# EAGLE design Rev1 (EAGLE 7.7.0)
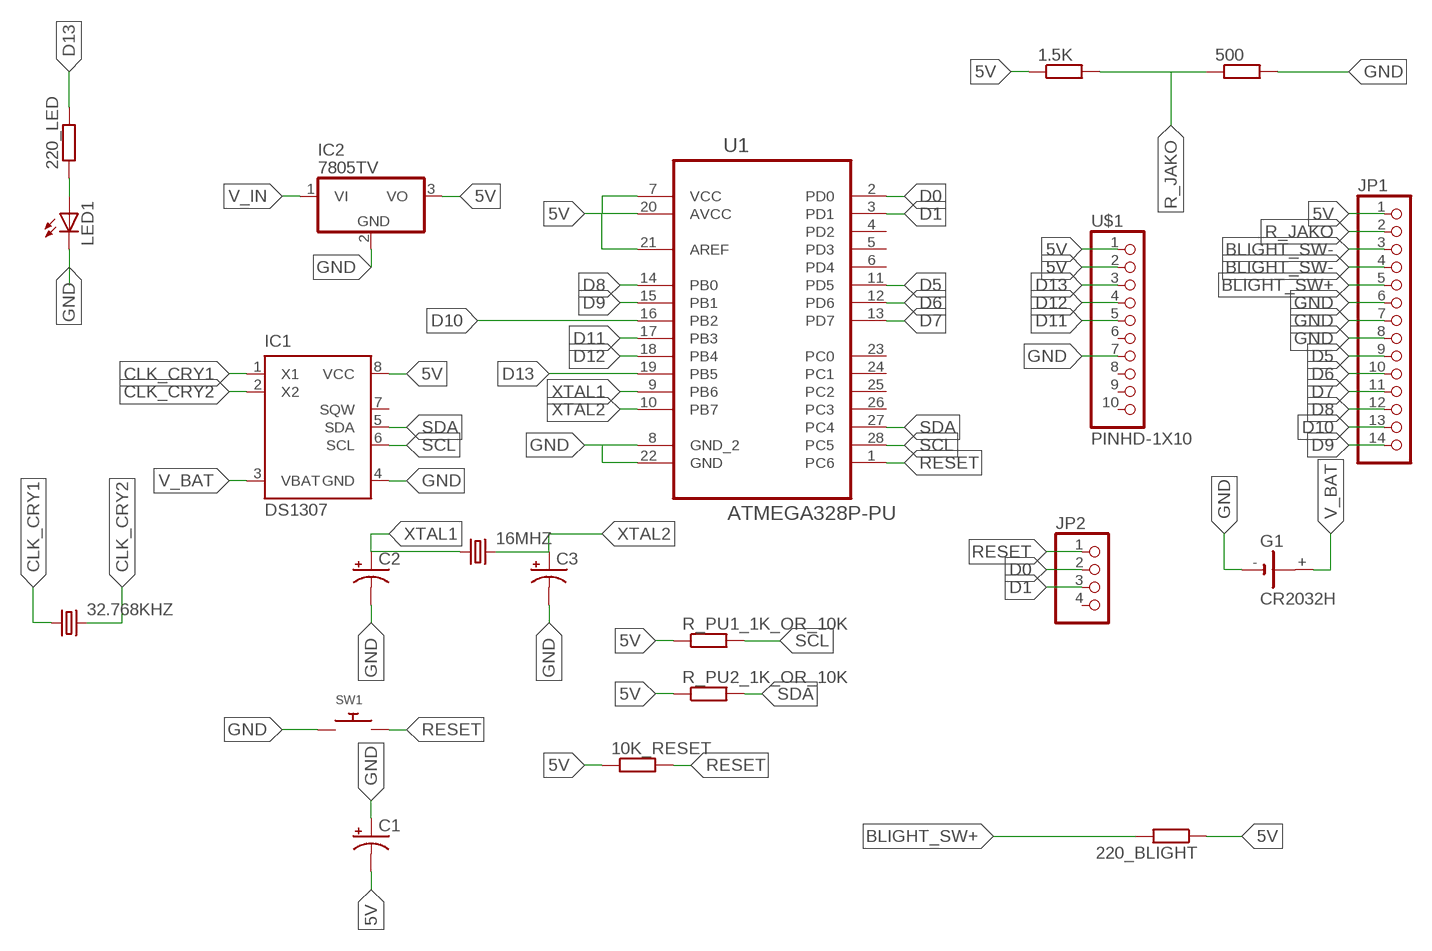
[diagram p0: schematic, sheet 1]

## Parts
1.5K  R-EU_0207/10  [0207/10]
10K_RESET  R-EU_0207/10  [0207/10]
16MHZ  CRYSTALHC49S  [HC49/S]
32.768KHZ  CRYSTALTC38H  [TC38H]
220_BLIGHT  R-EU_0207/10  [0207/10]
220_LED  R-EU_0207/10  [0207/10]
500  R-EU_0207/10  [0207/10]
C1  CPOL-USE2,5-6E  [E2,5-6E]
C2  CPOL-USE2,5-6E  [E2,5-6E]
C3  CPOL-USE2,5-6E  [E2,5-6E]
G1  CR2032H  [CR2032H]
IC1  DS1307  [DIP-8]
IC2  7805TV  [TO220V]
JP1  PINHD-1X14  [1X14]
JP2  PINHD-1X4  [1X04]
LED1  LED3MM  [LED3MM]
R_PU1_1K_OR_10K  R-EU_0207/10  [0207/10]
R_PU2_1K_OR_10K  R-EU_0207/10  [0207/10]
SW1  SWITCH_PUSHBUTTONEVQ-PE  [TACT_PANA-EVQ]
U1  ATMEGA328P-PU  [DIP254P762X457-28]
U$1  PINHD-1X10  [1X10-BIG]

## Nets
5V: 1.5K.1 10K_RESET.1 220_BLIGHT.1 C1.- IC1.8(VCC) IC2.3(VO) JP1.1 R_PU1_1K_OR_10K.1 R_PU2_1K_OR_10K.1 U1.7(VCC) U1.20(AVCC) U1.21(AREF) U$1.1 U$1.2
BLIGHT_SW+: 220_BLIGHT.2 JP1.5
BLIGHT_SW-: JP1.3 JP1.4
CLK_CRY1: 32.768KHZ.1 IC1.1(X1)
CLK_CRY2: 32.768KHZ.2 IC1.2(X2)
D0: JP2.2 U1.2(PD0)
D1: JP2.3 U1.3(PD1)
D5: JP1.9 U1.11(PD5)
D6: JP1.10 U1.12(PD6)
D7: JP1.11 U1.13(PD7)
D8: JP1.12 U1.14(PB0)
D9: JP1.14 U1.15(PB1)
D10: JP1.13 U1.16(PB2)
D11: U1.17(PB3) U$1.5
D12: U1.18(PB4) U$1.4
D13: 220_LED.2 U1.19(PB5) U$1.3
GND: 500.2 C1.+ C2.- C3.- G1.- IC1.4(GND) IC2.2(GND) JP1.6 JP1.7 JP1.8 LED1.K(C) SW1.P$1 U1.8(GND_2) U1.22(GND) U$1.7
N$23: 220_LED.1 LED1.A
R_JAKO: 1.5K.2 500.1 JP1.2
RESET: 10K_RESET.2 JP2.1 SW1.P$2 U1.1(PC6)
SCL: IC1.6(SCL) R_PU1_1K_OR_10K.2 U1.28(PC5)
SDA: IC1.5(SDA) R_PU2_1K_OR_10K.2 U1.27(PC4)
V_BAT: G1.+ IC1.3(VBAT)
V_IN: IC2.1(VI)
XTAL1: 16MHZ.1 C2.+ U1.9(PB6)
XTAL2: 16MHZ.2 C3.+ U1.10(PB7)
Unconnected: G1.+@1(+) IC1.7(SQW) JP2.4 U1.4(PD2) U1.5(PD3) U1.6(PD4) U1.23(PC0) U1.24(PC1) U1.25(PC2) U1.26(PC3) U$1.6 U$1.8 U$1.9 U$1.10

## Library data of the parts
1.5K 10K_RESET 220_BLIGHT 220_LED 500 R_PU1_1K_OR_10K R_PU2_1K_OR_10K = resistor:R-EU_: RESISTOR, European symbol
16MHZ = adafruit:CRYSTAL: CRYSTAL; OC_FARNELL: 1667008; OC_NEWARK: unknown
32.768KHZ = adafruit:CRYSTAL: CRYSTAL; OC_FARNELL: unknown; OC_NEWARK: unknown
C1-C3 = adafruit:CPOL-US: POLARIZED CAPACITOR, American symbol
G1 = battery:CR2032H: LI BATTERY Varta
IC1 = DS1307:DS1307: DS1307 - 64×8, Serial, I2C Real Time Clock
IC2 = linear:78*: Positive VOLTAGE REGULATOR Source: http://cache.national.com/ds/LM/LM78L05.pdf http://www.fairchildsemi.com/ds/LM/LM7805.pdf
JP1 = adafruit:PINHD-1X14: PIN HEADER
JP2 = pinhead:PINHD-1X4: PIN HEADER
LED1 = adafruit:LED: LED OSRAM: - CHIPLED LG R971, LG N971, LY N971, LG Q971, LY Q971, LO R971, LY R971 LH N974, LH R974 LS Q976, LO Q976, LY Q976 LO Q996 - Hyper CHIPLED LW Q18S LB Q993, LB Q99A, LB R99A - SideLED LS A670, LO A670, LY A670, LG A670, LP A670 LB A673, LV A673, LT A673, LW A673 LH A674 LY A675 LS A676, LA A676, LO A676, LY A676, LW A676 LS A679, LY A679, LG A679 - Hyper Micro SIDELED® LS Y876, LA Y876, LO Y876, LY Y876 LT Y87S - SmartLED LW L88C, LW L88S LB L89C, LB L89S, LG L890 LS L89K, LO L89K, LY L89K LS L896, LA L896, LO L896, LY L896 - TOPLED LS T670, LO T670, LY T670, LG T670, LP T670 LSG T670, LSP T670, LSY T670, LOP T670, LYG T670 LG T671, LOG T671, LSG T671 LB T673, LV T673, LT T673, LW T673 LH T674 LS T676, LA T676, LO T676, LY T676, LB T676, LH T676, LSB T676, LW T676 LB T67C, LV T67C, LT T67C, LS T67K, LO T67K, LY T67K, LW E67C LS E67B, LA E67B, LO E67B, LY E67B, LB E67C, LV E67C, LT E67C LW T67C LS T679, LY T679, LG T679 LS T770, LO T770, LY T770, LG T770, LP T770 LB T773, LV T773, LT T773, LW T773 LH T774 LS E675, LA E675, LY E675, LS T675 LS T776, LA T776, LO T776, LY T776, LB T776 LHGB T686 LT T68C, LB T68C - Hyper Mini TOPLED® LB M676 - Mini TOPLED Santana® LG M470 LS M47K, LO M47K, LY M47K Source: http://www.osram.convergy.de/
SW1 = adafruit:SWITCH_PUSHBUTTON: Buttons SOFTTOUCHSMD_SJ - Soft touch temporary push button (Super Junk Akihabara) Compatible with SKPMANE010 [Mouser: 688-SKPMAN] C&K_KSS = Digikey: KSS221GLFS
U1 = Atmel_By_element14_Batch_1-00:ATMEGA328P-PU: 8-bit Microcontroller with In-System Programmable Flash; MPN: ATMEGA328P-PU; OC_FARNELL: 1715487; OC_NEWARK: 15R0268; PACKAGE: PDIP-28; SUPPLIER: Atmel
U$1 = adafruit:PINHD-1X10: Pin header 1x10 0.1" spacing With round pins

## Board
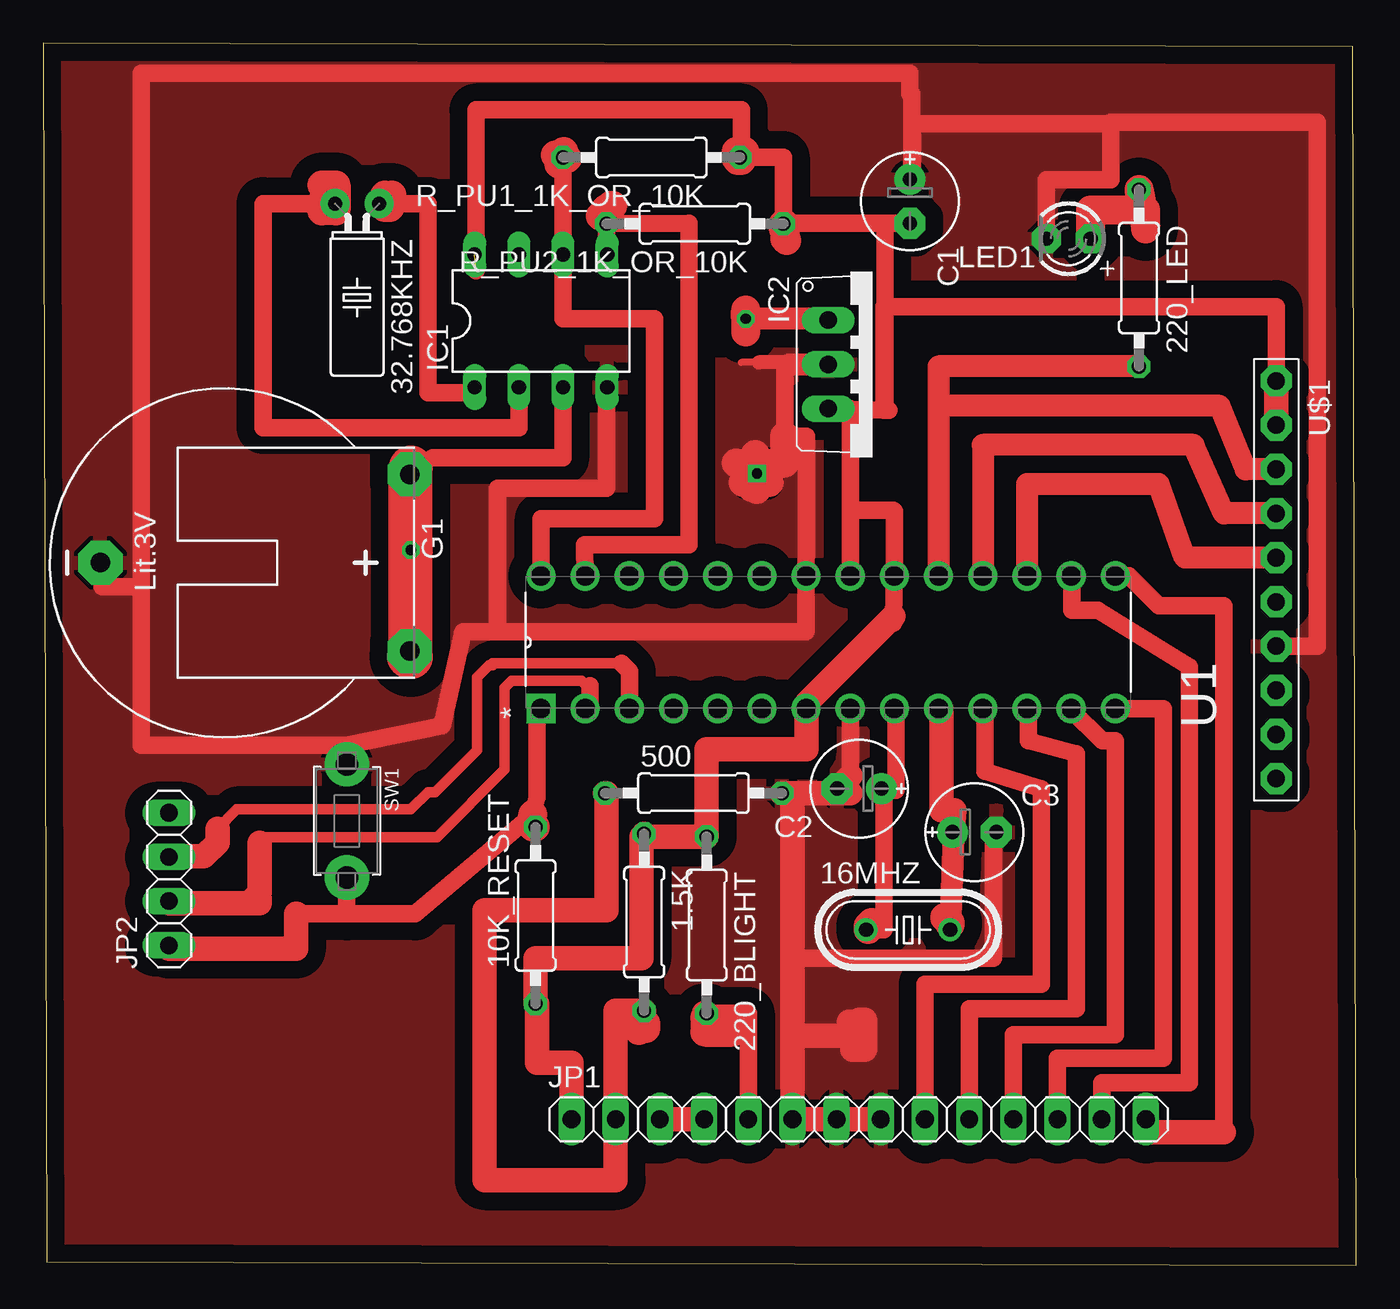
[diagram p1: board, top side]

Size 75.46 x 70.22 mm. Coordinates in mm from the lower left corner, seen from the top.
Outline: 0.2,0.2 75.46,0 75.26,70.02 0,70.22 0.2,0.2
Copper layers (1*16): Top 0.035mm / dielectric 1.5mm / Bottom 0.035mm
Design rules "default *": minimum track width 10mil, minimum drill 24mil, track to track 40mil, track to pad 30mil, pad to pad 20mil, via to via 20mil, smd to smd 8mil, copper to edge 40mil, drill to drill 8mil, minimum pad ring 10mil, minimum via ring 8mil, stop-mask expansion 4mil, vias tented up to drill 0mil, thermal gap 10mil

### Footprints (pad centres in the part's own frame; a part is rotated, then mirrored left to right if it is on the bottom)
0207/10 = drill 0.813 octagon: 1 -5.08,0; 2 5.08,0
HC49/S = drill 0.813: 1 -2.413,0; 2 2.413,0
TC38H = drill 0.813 pad 1.676: 1 -1.27,0; 2 1.27,0
E2,5-6E = drill 0.813 pad 1.778: + -1.27,0 | drill 0.813 pad 1.778 octagon: - 1.27,0
CR2032H = drill 1.118 pad 2.54 octagon: + 5.08,10.795; +@1 -5.08,10.795; - 0,-6.985
DIP-8 = drill 0.813 long: 1 -3.81,-3.81; 2 -1.27,-3.81; 3 1.27,-3.81; 4 3.81,-3.81; 5 3.81,3.81; 6 1.27,3.81; 7 -1.27,3.81; 8 -3.81,3.81
TO220V = drill 1.016 long: 1 -2.54,-2.54; 2 0,-2.54; 3 2.54,-2.54
1X14 = drill 1.016 long: 1 -16.51,0; 2 -13.97,0; 3 -11.43,0; 4 -8.89,0; 5 -6.35,0; 6 -3.81,0; 7 -1.27,0; 8 1.27,0; 9 3.81,0; 10 6.35,0; 11 8.89,0; 12 11.43,0; 13 13.97,0; 14 16.51,0
1X04 = drill 1.016 long: 1 -3.81,0; 2 -1.27,0; 3 1.27,0; 4 3.81,0
LED3MM = drill 0.813 pad 1.676 octagon: A -1.27,0; K 1.27,0
TACT_PANA-EVQ = drill 1.3 pad 2.54: P$1 -3.25,0; P$2 3.25,0
DIP254P762X457-28 = drill 1.118 square: 1 -7.62,33.02 | drill 1.118: 2 -7.62,30.48; 3 -7.62,27.94; 4 -7.62,25.4; 5 -7.62,22.86; 6 -7.62,20.32; 7 -7.62,17.78; 8 -7.62,15.24; 9 -7.62,12.7; 10 -7.62,10.16; 11 -7.62,7.62; 12 -7.62,5.08; 13 -7.62,2.54; 14 -7.62,0; 15 0,0; 16 0,2.54; 17 0,5.08; 18 0,7.62; 19 0,10.16; 20 0,12.7; 21 0,15.24; 22 0,17.78; 23 0,20.32; 24 0,22.86; 25 0,25.4; 26 0,27.94; 27 0,30.48; 28 0,33.02
1X10-BIG = drill 1.016 pad 1.778 octagon: 1 -11.43,0; 2 -8.89,0; 3 -6.35,0; 4 -3.81,0; 5 -1.27,0; 6 1.27,0; 7 3.81,0; 8 6.35,0; 9 8.89,0; 10 11.43,0

### Placement (x,y rotation side)
1.5K  34.53,19.72 270 top
10K_RESET  28.29,20.11 90 top
16MHZ  49.71,19.28 0 top
32.768KHZ  18.03,61.02 180 top
220_BLIGHT  38.13,19.56 270 top
220_LED  62.98,56.74 270 top
500  37.37,27.14 0 top
C1  49.82,61.15 270 top
C2  46.9,27.4 180 top
C3  53.52,24.9 0 top
G1  10.26,40.38 270 top
IC1  28.6,54.28 0 top
IC2  47.65,51.78 270 top
JP1  46.87,8.4 0 top
JP2  7.22,22.2 90 top
LED1  58.93,59 180 top
R_PU1_1K_OR_10K  34.95,63.67 180 top
R_PU2_1K_OR_10K  37.45,59.86 180 top
SW1  17.44,25.54 270 top
U1  61.62,39.62 90 top
U$1  70.87,39.4 270 top

### Tracks (layer width: path | path; a pad name or v marks a point on that pad's centre or on a via)
5V  (1 unrouted)
  Top 1.016: U1.21 46.38,43.4 | 46.38,43.4 46.38,49.24 IC2.3 48.62,49.15 48.37,49.15 | C1.- 48.37,59.88 | 48.37,59.88 42.53,59.88 R_PU2_1K_OR_10K.1 42.53,63.67 R_PU1_1K_OR_10K.1 40.12,63.67 40.12,66.4 24.87,66.4 24.87,57.15 | 46.38,43.4 48.87,43.4 48.92,43.35 U1.20 48.88,37.31 48.87,36.9 | 48.37,49.15 48.37,59.88 | 48.37,49.15 48.32,49.15 48.32,55.1 70.87,55.1 U$1.1
  Top 1.422: U$1.1 U$1.2 | JP1.1 30.36,11.65 28.37,11.65 28.37,15.03 10K_RESET.1 28.29,17.65 34.37,17.65 34.37,24.64 34.53,24.64 | U1.7 43.87,32 | 43.87,32 43.87,29.65 38.13,29.65 220_BLIGHT.1 34.53,24.64 | 34.53,24.64 1.5K.1 | 43.87,32 43.87,32.3 48.88,37.31
  Top 1.676: 42.52,59.6 42.62,59.6 | 42.62,59.6 42.62,59 42.72,58.9 | R_PU2_1K_OR_10K.1 42.62,59.86 42.62,59.6
BLIGHT_SW+
  Top 1.016: 220_BLIGHT.2 40.52,14.48 JP1.5
  Top 1.422: 220_BLIGHT.2 37.98,14.48
BLIGHT_SW-
  Top 1.422: JP1.4 JP1.3
CLK_CRY1
  Top 1.016: IC1.1 24.79,50.15 22.12,50.15 22.12,61.02 32.768KHZ.1
CLK_CRY2
  Top 1.016: IC1.2 27.33,48.15 12.62,48.15 12.62,61.02 32.768KHZ.2
D0
  Top 0.61: 12.42,24.7 12.42,24.3 12.72,24.6 22.62,24.6 26.52,28.5 26.52,33.2 26.92,33.6 30.92,33.6 31.22,33.3 31.42,33.3
  Top 1.016: U1.2 31.42,32 31.42,33.3
  Top 1.422: 12.42,24.3 12.42,21.4 12.12,21.1 12.42,21.1 12.42,20.8 7.22,20.8 JP2.2
D1
  Top 0.61: 33.22,34.6 25.82,34.6 25.82,34.5 25.62,34.5 24.92,33.8 24.92,29.6 22.52,27.2 22.12,27.2 21.12,26.2 11.12,26.2 10.02,25.1
  Top 1.016: U1.3 33.68,34.14 33.22,34.6
  Top 1.422: 10.02,25.1 10.02,24.3 9.22,23.5 7.25,23.5 JP2.3
D5
  Top 1.016: U1.11 54.12,32 54.12,28.4 57.37,27.4 57.37,16.15 50.68,16.15 JP1.9
D6
  Top 1.016: U1.12 56.62,32 56.62,30.15 59.37,29.4 59.37,14.75 53.22,14.75 JP1.10
D7
  Top 1.016: U1.13 59.08,31.94 60.87,30.15 61.62,30.15 61.62,13.25 55.76,13.25 JP1.11
D8
  Top 1.016: U1.14 64.37,32 64.37,11.9 58.3,11.9 JP1.12
D9
  Top 1.016: U1.15 62.4,39.62 64.12,37.9 67.87,37.9 67.87,7.65
  Top 1.422: 67.87,7.65 63.38,7.65 JP1.14
D10
  Top 1.016: U1.16 59.12,39.62 59.12,37.65 60.62,37.65 65.87,34.4 65.87,10.5 60.84,10.5 JP1.13
D11
  Top 1.27: U$1.5 65.62,40.67 64.12,44.9 56.54,44.9 U1.17
D12
  Top 1.27: U$1.4 67.87,43.21 66.12,47.15 54,47.15 U1.18
D13
  Top 1.27: U$1.3 69.12,45.75 67.62,49.4 51.46,49.4 | 51.46,49.4 U1.19 | 220_LED.2 51.46,51.66 51.46,49.4
GND
  Top 0.406: 41.12,51.9 40.12,51.9
  Top 0.813: 45.11,51.9 41.12,51.9
  Top 1.016: U1.8 46.38,28.15 | 42.62,51.65 42.62,47.65 43.87,47.65 43.87,41.62 U1.22 43.84,36.4 26.12,36.4 | 42.62,51.65 44.98,51.65 IC2.2 45.11,51.9 42.87,51.9 42.62,51.65 | 61.37,65.7 61.47,65.6 49.97,65.6 49.97,62.42 C1.+ 49.92,62.42 49.92,67.3 49.82,67.3 49.82,68.5 5.62,68.5 5.62,39 | 61.37,65.7 61.37,62.4 57.66,62.4 LED1.K | IC1.4 32.37,50.47 32.37,44.65 26.12,44.65 26.12,36.4 | C3.- 54.62,24.9 54.62,17.65 43.06,17.65 | U$1.7 73.22,35.59 73.22,65.7 61.37,65.7 | 26.12,36.4 24.12,36.4 22.92,31 17.44,29.9 | 17.44,29.9 5.62,29.9 5.62,39 | 5.62,39 3.38,39 G1.- | 17.44,29.9 SW1.P$1
  Top 1.422: 46.38,28.15 C2.- 46.38,27.14 500.2 43.06,27.14 43.06,17.65 JP1.6 JP1.7 JP1.8 | 43.82,13.2 46.32,13.2 | 46.42,13.2 46.32,13.2 | 46.32,13.2 46.32,14 46.92,14 46.92,14.1 47.22,14.1 47.22,12.7 46.52,12.7 46.52,12.4 47.22,12.4 47.22,12.5
  Top 1.676: 40.92,46.6 40.92,44.7 | 40.92,44.7 41.02,44.6 | 39.82,46.1 41.52,46.1 | 41.52,46.1 41.62,46 41.62,45.1 41.72,45 40.72,45 | 40.72,45 40.22,45 | 41.52,46.1 42.62,46.1 42.62,47.65 | 40.92,44.7 40.72,44.7 40.72,45
  pour Top: 0.12,70.1 75.47,70 75.47,0.2 3.47,0.2 0.22,0
N$2  (via drill 0.6)
  Top 1.27: 45.37,54.4 v40.37,54.4
  Top 1.676: 40.37,53.65 v40.37,54.4 40.37,54.9
N$3
  Top 1.676: 19.62,60.8 19.92,60.8 19.92,61.1 19.62,61.1 19.62,61.5 20.02,61.5
N$16
  Top 1.676: 16.02,62.1 16.82,62.1 16.82,60.6 16.02,60.6 16.02,61.1
N$18  (via drill 0.6)
  other vias: 41.02,45.5
N$20
  Top 1.676: 34.32,13.9 34.62,13.9 34.62,13.6 34.22,13.6 34.22,13.5
N$21
  Top 1.676: 38.22,14.2 38.02,14.2 38.02,13.4 39.62,13.4
N$22
  Top 1.676: 32.52,60.4 32.52,60.5 32.32,60.7 32.52,60.7 32.72,60.9 32.62,60.9 32.02,60.3
N$23
  Top 1.676: 220_LED.1 63.37,59.57 63.37,60.65 60.2,60.65 LED1.A
N$24
  Top 1.676: 29.62,63.3 29.62,63.6 29.42,63.8 29.72,63.8 29.92,64 29.92,63.8 30.12,63.6
N$25
  Top 1.676: 40.12,63.5 39.92,63.5 39.82,63.6 39.82,64 40.32,64
N$26
  Top 1.676: 52.12,19.6 52.12,19.7 51.82,20
R_JAKO
  Top 1.422: 500.1 32.37,27.14 32.37,20.4 25.37,20.4 25.37,4.9 32.9,4.9 JP1.2 32.9,14.64 1.5K.2
RESET
  Top 1.016: U1.1 28.37,32 28.37,26.9 28.12,25.9 21.37,20.2 17.44,20.2 | 17.44,20.2 14.55,20.2 | 17.44,20.2 SW1.P$2
  Top 1.422: 14.55,20.2 14.52,20.2 14.52,18.2 7.22,18.2 JP2.1
  Top 1.676: 10K_RESET.2 28.12,25.19 28.12,25.9
SCL
  Top 1.016: U1.28 28.62,42.9 35.12,42.9 35.12,54.4 29.87,54.4 IC1.6 R_PU1_1K_OR_10K.2
SDA
  Top 1.016: U1.27 31.12,41.39 31.12,41.4 37.12,41.4 37.12,59.9 R_PU2_1K_OR_10K.2 IC1.5
V_BAT  (via drill 0.6)
  Top 1.016: IC1.3 29.87,46.4 22.37,46.4 21.12,45.85 | G1.+ 21.12,34.95
  Top 2.54: 21.02,35 21.12,34.95 v21.12,41.1 21.12,45.85
XTAL1
  Top 1.016: U1.9 49.02,32 49.02,27.3 48.17,27.3 C2.+ 48.32,27.4 48.32,19.3 47.42,19.3 47.3,19.3 16MHZ.1
  Top 1.676: 47.42,19.3 47.42,19.5 47.62,19.7
XTAL2
  Top 1.27: 52.37,26.15 16MHZ.2
  Top 1.422: U1.10 51.62,32 51.62,26.15 52.37,26.15 C3.+